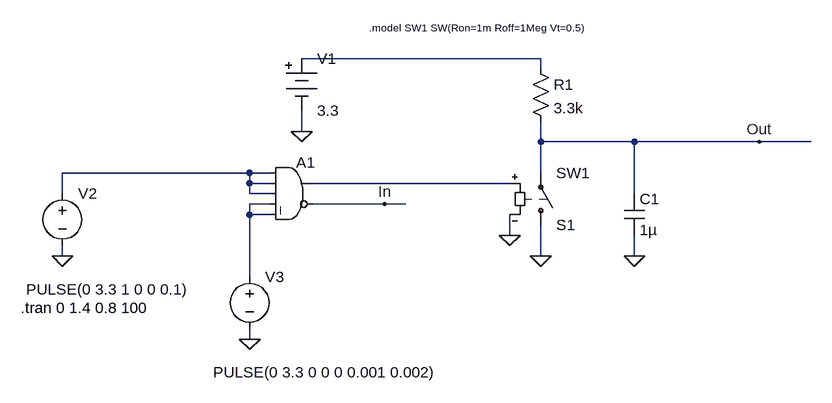
[diagram p0: schematic simulacionAntiRebote.asc]
simulacionAntiRebote.asc, the LTspice schematic file:
Version 4
SHEET 1 880 680
WIRE 352 48 -16 48
WIRE 352 64 352 48
WIRE -16 160 -16 128
WIRE 352 176 352 144
WIRE 496 176 352 176
WIRE 688 176 496 176
WIRE 768 176 688 176
WIRE -96 224 -384 224
WIRE -64 224 -96 224
WIRE 352 224 352 176
WIRE -96 240 -96 224
WIRE -64 240 -96 240
WIRE 304 240 0 240
WIRE -384 256 -384 224
WIRE -96 256 -96 240
WIRE -64 256 -96 256
WIRE 496 256 496 176
WIRE -64 272 -96 272
WIRE 112 272 0 272
WIRE 144 272 112 272
WIRE -96 288 -96 272
WIRE -64 288 -96 288
WIRE 304 320 304 288
WIRE -384 352 -384 336
WIRE 352 352 352 304
WIRE 496 352 496 320
WIRE -96 384 -96 288
WIRE -96 480 -96 464
FLAG 496 352 0
FLAG -384 352 0
FLAG 352 352 0
FLAG -16 160 0
FLAG 304 320 0
FLAG -96 480 0
FLAG 688 176 Out
FLAG 112 272 In
SYMBOL voltage -384 240 R0
WINDOW 3 -56 163 Left 2
WINDOW 123 0 0 Left 2
WINDOW 39 0 0 Left 2
SYMATTR Value PULSE(0 3.3 1 0 0 0.1)
SYMATTR InstName V2
SYMBOL res 336 48 R0
SYMATTR InstName R1
SYMATTR Value 3.3k
SYMBOL cap 480 256 R0
SYMATTR InstName C1
SYMATTR Value 1µ
SYMBOL sw 352 320 M180
SYMATTR InstName S1
SYMATTR Value SW1
SYMBOL Misc\\battery -16 32 R0
SYMATTR InstName V1
SYMATTR Value 3.3
SYMBOL Digital\\and -32 192 R0
SYMATTR InstName A1
SYMATTR SpiceLine Vhigh=3.3
SYMBOL voltage -96 368 R0
WINDOW 3 -56 163 Left 2
WINDOW 123 0 0 Left 2
WINDOW 39 0 0 Left 2
SYMATTR Value PULSE(0 3.3 0 0 0 0.001 0.002)
SYMATTR InstName V3
TEXT -448 432 Left 2 !.tran 0 1.4 0.8 100
TEXT 88 0 Left 1 !.model SW1 SW(Ron=1m Roff=1Meg Vt=0.5)

The netlist it stands for:
* simulacionAntiRebote.asc
V2 N002 0 PULSE(0 3.3 1 0 0 0.1)
R1 N001 Out 3.3k
C1 Out 0 1µ
S1 0 Out N003 0 SW1
V1 N001 0 3.3
A1 N002 N002 N002 N004 N004 In N003 0 AND Vhigh=3.3
V3 N004 0 PULSE(0 3.3 0 0 0 0.001 0.002)
.tran 0 1.4 0.8 100
.model SW1 SW(Ron=1m Roff=1Meg Vt=0.5)
.backanno
.end